# Altium schematic sheet Connectors.SchDoc
size A4; SheetNumber: 1; SheetTotal: 8
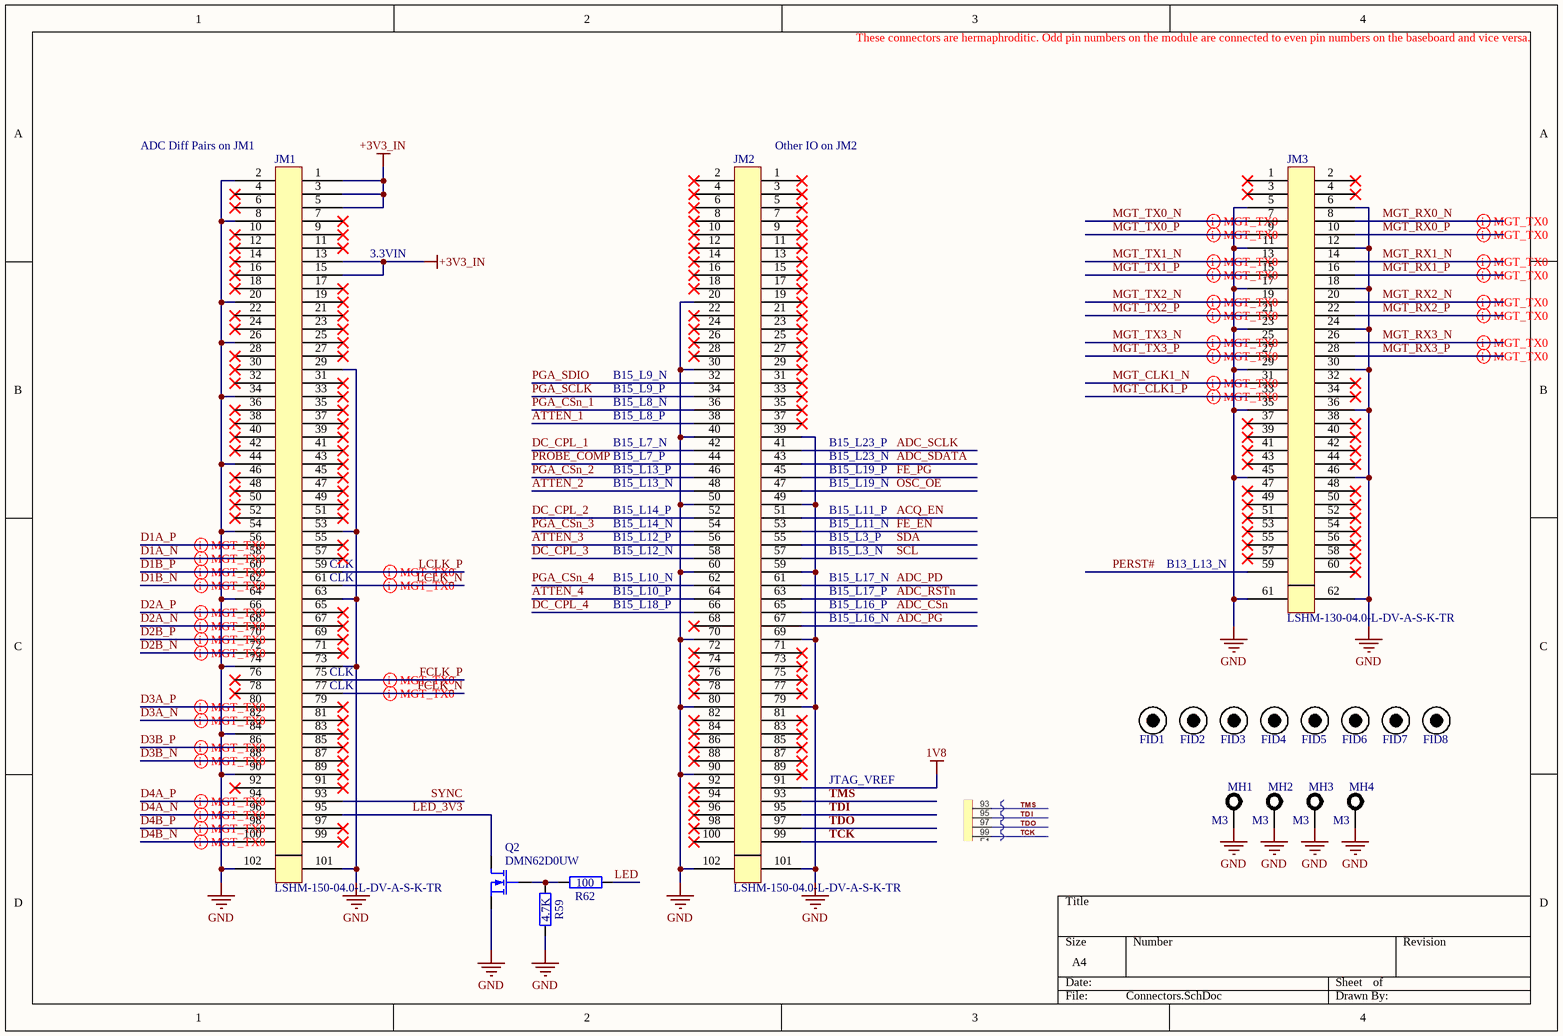
[diagram p0: Connectors.SchDoc]

## Parts
FID1  PCB  [GEN_FID]  (value not drawn)  (no BOM)
FID2  PCB  [GEN_FID]  (value not drawn)  (no BOM)
FID3  PCB  [GEN_FID]  (value not drawn)  (no BOM)
FID4  PCB  [GEN_FID]  (value not drawn)  (no BOM)
FID5  PCB  [GEN_FID]  (value not drawn)  (no BOM)
FID6  PCB  [GEN_FID]  (value not drawn)  (no BOM)
FID7  PCB  [GEN_FID]  (value not drawn)  (no BOM)
FID8  PCB  [GEN_FID]  (value not drawn)  (no BOM)
JM1  LSHM-150-04.0-L-DV-A-S-K-TR  [SAM_LSHM-150-XX.X-XX-DV-A-S]
JM2  LSHM-150-04.0-L-DV-A-S-K-TR  [SAM_LSHM-150-XX.X-XX-DV-A-S]
JM3  LSHM-130-04.0-L-DV-A-S-K-TR  [SAM_LSHM-130-XX.X-XX-DV-A-S]
MH1  M3  [MH M3]  (no BOM)
MH2  M3  [MH M3]  (no BOM)
MH3  M3  [MH M3]  (no BOM)
MH4  M3  [MH M3]  (no BOM)
Q2  DMN62D0UW  [GEN_SOT_323]
R59  4.7K  [GEN_R_0201]
R62  100  [GEN_R_0201]

## Nets
1V8: JM2.91
+3V3_IN: JM1.1 JM1.3 JM1.5 JM1.13 JM1.15
GND: JM1.2 JM1.8 JM1.20 JM1.26 JM1.29 JM1.34 JM1.44 JM1.53 JM1.54 JM1.63 JM1.64 JM1.73 JM1.74 JM1.84 JM1.90 JM1.101 JM1.102 JM2.20 JM2.30 JM2.39 JM2.40 JM2.49 JM2.50 JM2.59 JM2.60 JM2.69 JM2.70 JM2.79 JM2.80 JM2.90 JM2.101 JM2.102 JM3.5 JM3.6 JM3.11 JM3.12 JM3.17 JM3.18 JM3.23 JM3.24 JM3.29 JM3.30 JM3.35 JM3.36 JM3.45 JM3.46 JM3.61 JM3.62 MH1.1 MH2.1 MH3.1 MH4.1 Q2.3(S) R59.2
ACQ_EN: JM2.51
ADC_CSn: JM2.65
ADC_PD: JM2.61
ADC_PG: JM2.67
ADC_RSTn: JM2.63
ADC_SCLK: JM2.41
ADC_SDATA: JM2.43
ATTEN_1: JM2.38
ATTEN_2: JM2.48
ATTEN_3: JM2.56
ATTEN_4: JM2.64
D1A_N: JM1.58
D1A_P: JM1.56
D1B_N: JM1.62
D1B_P: JM1.60
D2A_N: JM1.68
D2A_P: JM1.66
D2B_N: JM1.72
D2B_P: JM1.70
D3A_N: JM1.82
D3A_P: JM1.80
D3B_N: JM1.88
D3B_P: JM1.86
D4A_N: JM1.96
D4A_P: JM1.94
D4B_N: JM1.100
D4B_P: JM1.98
DC_CPL_1: JM2.42
DC_CPL_2: JM2.52
DC_CPL_3: JM2.58
DC_CPL_4: JM2.66
FCLK_N: JM1.77
FCLK_P: JM1.75
FE_EN: JM2.53
FE_PG: JM2.45
LCLK_N: JM1.61
LCLK_P: JM1.59
LED: R62.1
LED_3V3: JM1.95 Q2.1(D)
MGT_CLK1_N: JM3.31
MGT_CLK1_P: JM3.33
MGT_RX0_N: JM3.8
MGT_RX0_P: JM3.10
MGT_RX1_N: JM3.14
MGT_RX1_P: JM3.16
MGT_RX2_N: JM3.20
MGT_RX2_P: JM3.22
MGT_RX3_N: JM3.26
MGT_RX3_P: JM3.28
MGT_TX0_N: JM3.7
MGT_TX0_P: JM3.9
MGT_TX1_N: JM3.13
MGT_TX1_P: JM3.15
MGT_TX2_N: JM3.19
MGT_TX2_P: JM3.21
MGT_TX3_N: JM3.25
MGT_TX3_P: JM3.27
OSC_OE: JM2.47
PERST#: JM3.59
PGA_CSn_1: JM2.36
PGA_CSn_2: JM2.46
PGA_CSn_3: JM2.54
PGA_CSn_4: JM2.62
PGA_SCLK: JM2.34
PGA_SDIO: JM2.32
PROBE_COMP: JM2.44
SCL: JM2.57
SDA: JM2.55
SYNC: JM1.93
TCK: JM2.99
TDI: JM2.95
TDO: JM2.97
TMS: JM2.93
NetQ2_2: Q2.2(G) R59.1 R62.2

Not connected (* = marked no-connect by the designer): JM1 4* 6* 7* 9* 10* 11* 12* 14* 16* 17* 18* 19* 21* 22* 23* 24* 25* 27* 28* 30* 31* 32* 33* 35* 36* 37* 38* 39* 40* 41* 42* 43* 45* 46* 47* 48* 49* 50* 51* 52* 55* 57* 65* 67* 69* 71* 76* 78* 79* 81* 83* 85* 87* 89* 91* 92* 97* 99*; JM2 1* 2* 3* 4* 5* 6* 7* 8* 9* 10* 11* 12* 13* 14* 15* 16* 17* 18* 19* 21* 22* 23* 24* 25* 26* 27* 28* 29* 31* 33* 35* 37* 68* 71* 72* 73* 74* 75* 76* 77* 78* 81* 82* 83* 84* 85* 86* 87* 88* 89* 92* 94* 96* 98* 100*; JM3 1* 2* 3* 4* 32* 34* 37* 38* 39* 40* 41* 42* 43* 44* 47* 48* 49* 50* 51* 52* 53* 54* 55* 56* 57* 58* 60*

## Layout directives
differential pair; differential pair class PCIe: MGT_CLK1_N, MGT_CLK1_P, MGT_RX0_N, MGT_RX0_P, MGT_RX1_N, MGT_RX1_P, MGT_RX2_N, MGT_RX2_P, MGT_RX3_N, MGT_RX3_P, MGT_TX0_N, MGT_TX0_P, MGT_TX1_N, MGT_TX1_P, MGT_TX2_N, MGT_TX2_P, MGT_TX3_N, MGT_TX3_P
differential pair; differential pair class ADC LVDS: D1A_N, D1A_P, D1B_N, D1B_P, D2A_N, D2A_P, D2B_N, D2B_P, D3A_N, D3A_P, D3B_N, D3B_P, D4A_N, D4A_P, D4B_N, D4B_P, FCLK_N, FCLK_P, LCLK_N, LCLK_P

## Notes on the sheet
- These connectors are hermaphroditic. Odd pin numbers on the module are connected to even pin numbers on the baseboard and vice versa.
- (near JM1) ADC Diff Pairs on JM1
- (near JM2) Other IO on JM2
- 3.3VIN
- B15_L9_N
- B15_L9_P
- B15_L8_N
- B15_L8_P
- B15_L7_N
- B15_L23_P
- B15_L7_P
- B15_L13_P
- B15_L13_N
- B15_L14_P
- B15_L23_N
- B15_L19_P
- B15_L19_N
- B15_L11_P
- (near JM1) CLK
- B15_L14_N
- B15_L12_P
- B15_L12_N
- B15_L10_N
- B15_L11_N
- B15_L3_P
- B15_L3_N
- B15_L17_N
- B13_L13_N
- B15_L10_P
- B15_L18_P
- B15_L17_P
- B15_L16_P
- B15_L16_N
- JTAG_VREF

## Library data of the parts
FID1-FID8 = FID 1mm
JM1 JM2 = CONN LSHM-150-04.0-L-DV-A-S-K-TR: Supplier 1: Digi-Key; Supplier Part Number 1: SAM9033CT-ND
JM3 = CONN LSHM-130-04.0-L-DV-A-S-K-TR: Supplier 1: Digi-Key; Supplier Part Number 1: SAM9034CT-ND
MH1-MH4 = MH M3
Q2 = NMOS DMN62D0UW: Vdss: 60V; Id: 340mA; Max Power: 320mW; Supplier 1: Digi-Key; Supplier Part Number 1: DMN62D0UW-7DICT-ND
R59 = RES 4.7K OHM 1% 1/20W 0201: Tolerance: 1%; Power Rating: 0.05W; Package: 0201; Value: 4.7K; Supplier 1: Digi-Key; Supplier Part Number 1: 311-4.70KMTR-ND
R62 = RES 100 OHM 1% 1/20W 0201: Tolerance: 1%; Power Rating: 0.05W; Package: 0201; Value: 100; Supplier 1: Digi-Key; Supplier Part Number 1: 311-100MCT-ND